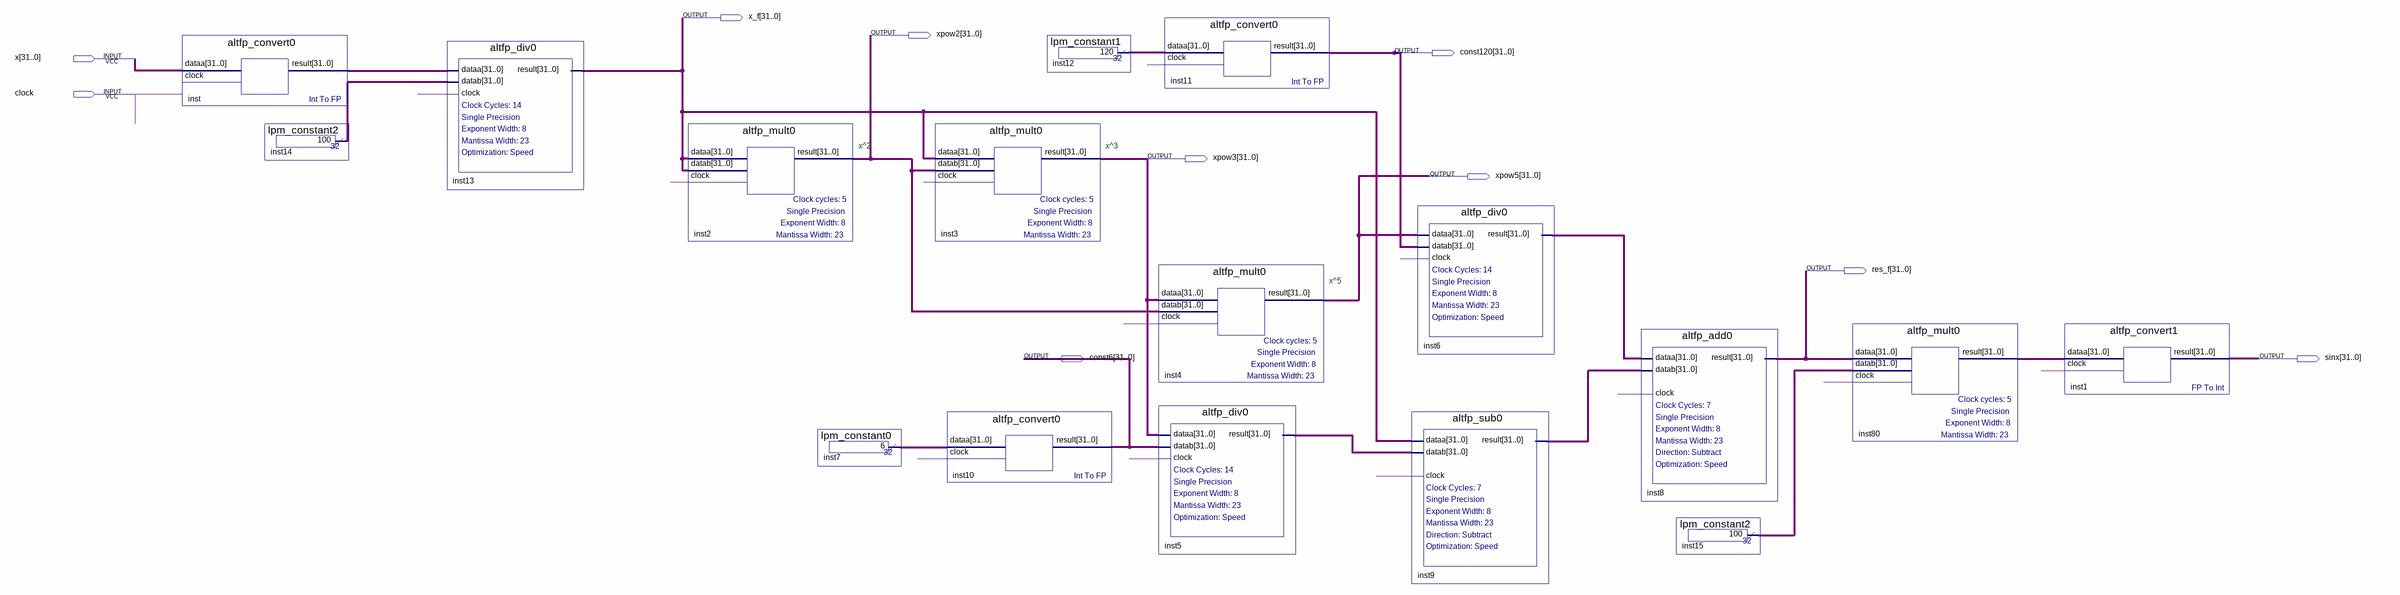
[diagram p0: schematic sheet]
// Quartus schematic calcula_seno_f.bdf as structural Verilog: 17 symbols, 10 pins
module calcula_seno_f (
  input  [31:0] x,
  input  clock,
  output [31:0] x_f,
  output [31:0] xpow2,
  output [31:0] const120,
  output [31:0] xpow3,
  output [31:0] xpow5,
  output [31:0] res_f,
  output [31:0] const6,
  output [31:0] sinx
);

  wire [31:0] inst5_result, inst6_result, inst7_result, inst9_result, inst12_result, inst14_result,
       inst15_result, inst80_result, inst_result;

  altfp_convert0 inst (.dataa(x), .clock(clock), .result(inst_result));
  lpm_constant2 inst14 (.result(inst14_result));
  altfp_div0 inst13 (.dataa(inst_result), .datab(inst14_result), .clock(clock), .result(x_f));
  altfp_mult0 inst2 (.dataa(x_f), .datab(x_f), .clock(clock), .result(xpow2));
  lpm_constant0 inst7 (.result(inst7_result));
  altfp_mult0 inst3 (.dataa(x_f), .datab(xpow2), .clock(clock), .result(xpow3));
  altfp_convert0 inst10 (.dataa(inst7_result), .clock(clock), .result(const6));
  lpm_constant1 inst12 (.result(inst12_result));
  altfp_mult0 inst4 (.dataa(xpow3), .datab(xpow2), .clock(clock), .result(xpow5));
  altfp_div0 inst5 (.dataa(xpow3), .datab(const6), .clock(clock), .result(inst5_result));
  altfp_convert0 inst11 (.dataa(inst12_result), .clock(clock), .result(const120));
  altfp_div0 inst6 (.dataa(xpow5), .datab(const120), .clock(clock), .result(inst6_result));
  altfp_sub0 inst9 (.dataa(x_f), .datab(inst5_result), .clock(clock), .result(inst9_result));
  altfp_add0 inst8 (.dataa(inst6_result), .datab(inst9_result), .clock(clock), .result(res_f));
  lpm_constant2 inst15 (.result(inst15_result));
  altfp_mult0 inst80 (.dataa(res_f), .datab(inst15_result), .clock(clock), .result(inst80_result));
  altfp_convert1 inst1 (.dataa(inst80_result), .clock(clock), .result(sinx));

  // Other names for the same wires on the sheet: g_clock = clock

  // Notes on the sheet:
  //   x^2
  //   x^3
  //   x^5
endmodule
